# Altium project IDC_SMA_Adapter.PrjPCB
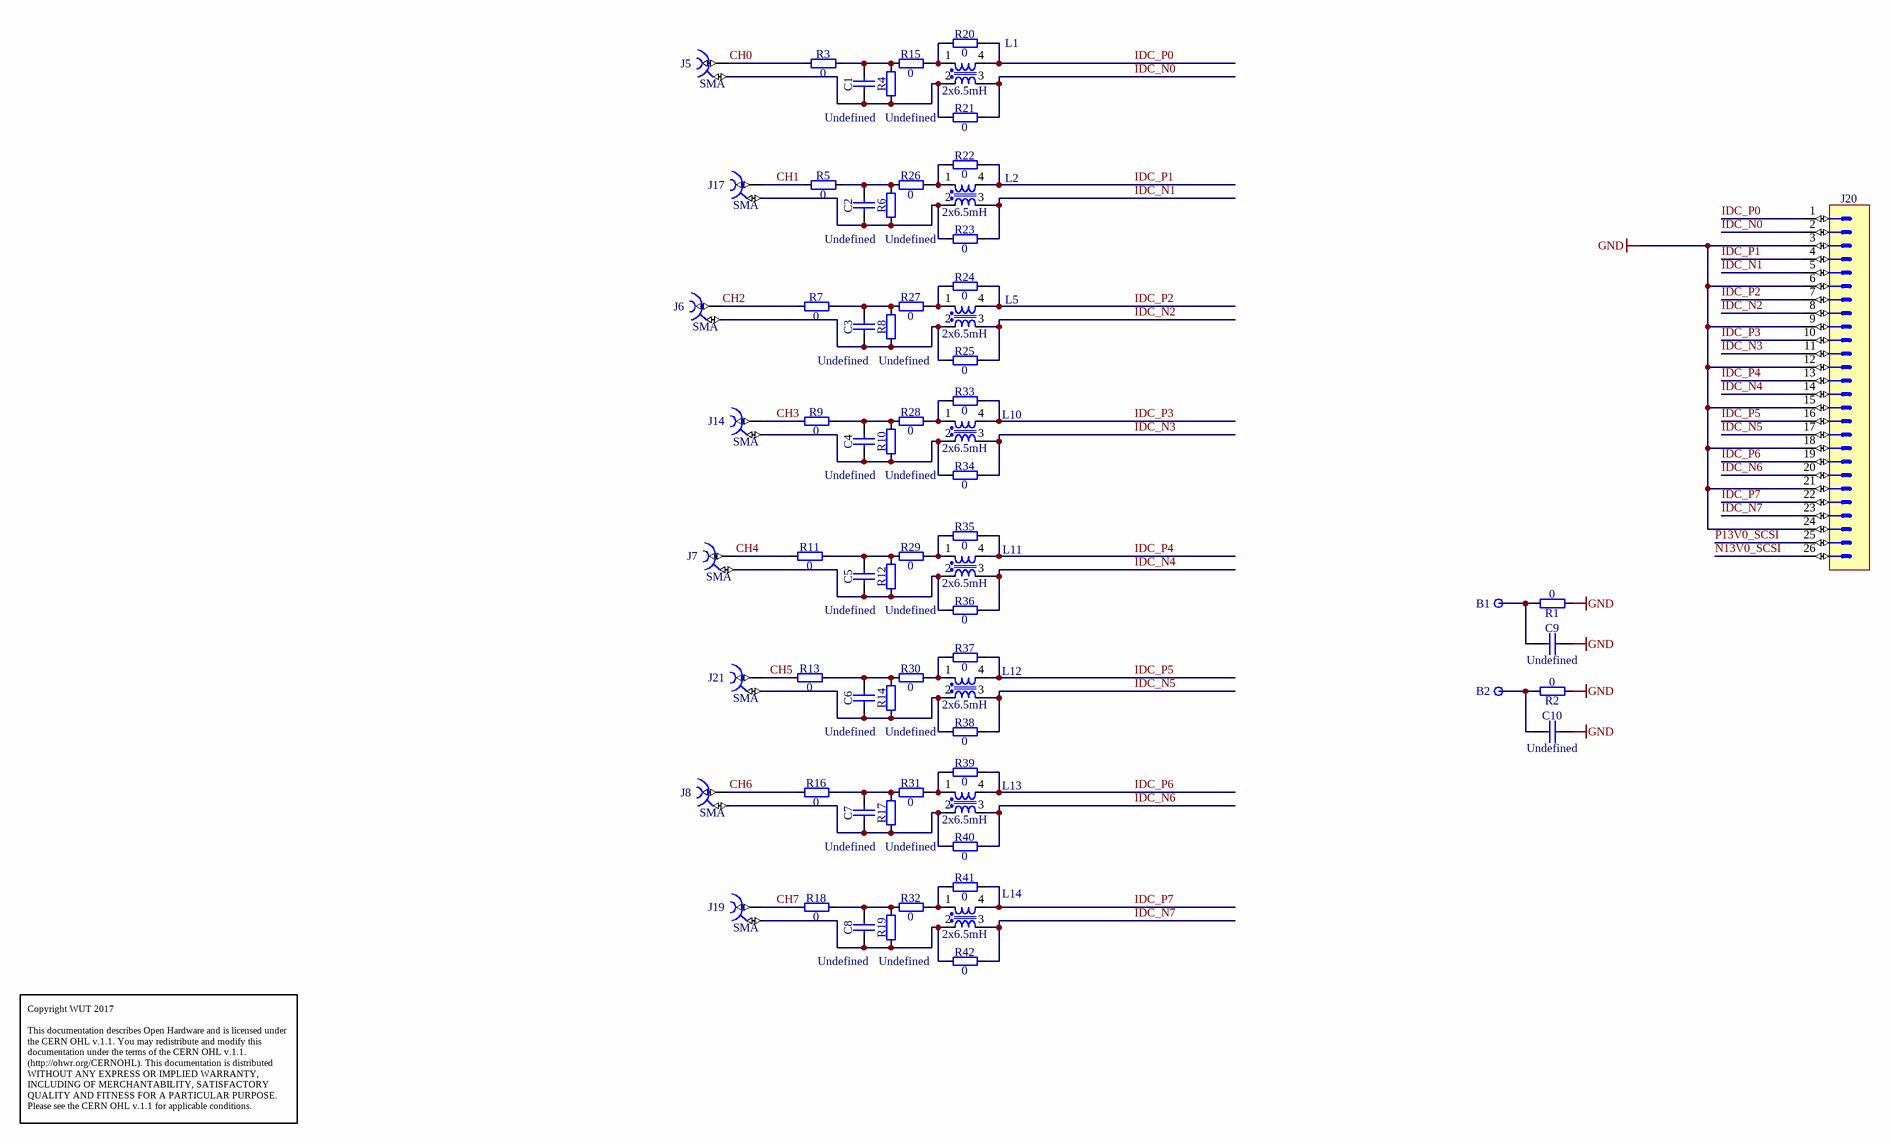
[diagram p0: IDC_SMA_Adapter.SchDoc]
1 sheet, 71 parts. Net scope: global (net labels, ports and power ports of the same name join across sheets).
Board files: IDC_SMA_Adapter.PCBDOC, Panel_IDC_SMA_Adapter.PcbDoc

## Sheet IDC_SMA_Adapter.SchDoc: IDC to SMA
size 420 x 297 mm; Author: G.K.; CompanyName: WUT; DrawnBy: G.K.; Organization: WUT ISE; Address1: Warsaw Univeristy of Technology; Address2: Nowowiejska 15/19; DocumentNumber: 3; Revision: -; SheetNumber: 3; SheetTotal: 7; EDA_Number: ARTIQ; Projet: ARTIQ/SINARA; ModifiedBy: -; CreateDate: XX/XX/XXXX; CheckedDate: -; Title2: adapter v1.0; DivGrp: ISE; Designer: G.K.; ModifiedDate: -; ProjectName: 32 CHANNEL 16bit DAC

### Parts
B1  Plated Hole  [MTG270_500]  (value not drawn)
B2  Plated Hole  [MTG270_500]  (value not drawn)
C1  Undefined  [CAPC2012X135N]
C2  Undefined  [CAPC2012X135N]
C3  Undefined  [CAPC2012X135N]
C4  Undefined  [CAPC2012X135N]
C5  Undefined  [CAPC2012X135N]
C6  Undefined  [CAPC2012X135N]
C7  Undefined  [CAPC2012X135N]
C8  Undefined  [CAPC2012X135N]
C9  Undefined  [CAPC2012X135N]
C10  Undefined  [CAPC2012X135N]
J5  SMA  [DELOCK_65848]
J6  SMA  [DELOCK_65848]
J7  SMA  [DELOCK_65848]
J8  SMA  [DELOCK_65848]
J14  SMA  [MOLEX_73251-2120]
J17  SMA  [MOLEX_73251-2120]
J19  SMA  [MOLEX_73251-2120]
J20  Header 26  [3M_N2526-6003RB]  (value not drawn)
J21  SMA  [MOLEX_73251-2120]
L1  2x6.5mH  [IND_WURTH_WE-SL2]
L2  2x6.5mH  [IND_WURTH_WE-SL2]
L5  2x6.5mH  [IND_WURTH_WE-SL2]
L10  2x6.5mH  [IND_WURTH_WE-SL2]
L11  2x6.5mH  [IND_WURTH_WE-SL2]
L12  2x6.5mH  [IND_WURTH_WE-SL2]
L13  2x6.5mH  [IND_WURTH_WE-SL2]
L14  2x6.5mH  [IND_WURTH_WE-SL2]
R1  0  [RESC1608X55N]
R2  0  [RESC1608X55N]
R3  0  [RESC1608X55N]
R4  Undefined  [RESC1608X55N]
R5  0  [RESC1608X55N]
R6  Undefined  [RESC1608X55N]
R7  0  [RESC1608X55N]
R8  Undefined  [RESC1608X55N]
R9  0  [RESC1608X55N]
R10  Undefined  [RESC1608X55N]
R11  0  [RESC1608X55N]
R12  Undefined  [RESC1608X55N]
R13  0  [RESC1608X55N]
R14  Undefined  [RESC1608X55N]
R15  0  [RESC1608X55N]
R16  0  [RESC1608X55N]
R17  Undefined  [RESC1608X55N]
R18  0  [RESC1608X55N]
R19  Undefined  [RESC1608X55N]
R20  0  [RESC1608X55N]
R21  0  [RESC1608X55N]
R22  0  [RESC1608X55N]
R23  0  [RESC1608X55N]
R24  0  [RESC1608X55N]
R25  0  [RESC1608X55N]
R26  0  [RESC1608X55N]
R27  0  [RESC1608X55N]
R28  0  [RESC1608X55N]
R29  0  [RESC1608X55N]
R30  0  [RESC1608X55N]
R31  0  [RESC1608X55N]
R32  0  [RESC1608X55N]
R33  0  [RESC1608X55N]
R34  0  [RESC1608X55N]
R35  0  [RESC1608X55N]
R36  0  [RESC1608X55N]
R37  0  [RESC1608X55N]
R38  0  [RESC1608X55N]
R39  0  [RESC1608X55N]
R40  0  [RESC1608X55N]
R41  0  [RESC1608X55N]
R42  0  [RESC1608X55N]

### Nets
GND: C9.2 C10.2 J20.3 J20.6 J20.9 J20.12 J20.15 J20.18 J20.21 J20.24 R1.1 R2.1
CH0: J5.1 R3.1
CH1: J17.1 R5.1
CH2: J6.1 R7.1
CH3: J14.1 R9.1
CH4: J7.1 R11.1
CH5: J21.1 R13.1
CH6: J8.1 R16.1
CH7: J19.1 R18.1
IDC_N0: J20.2 L1.3 R21.2
IDC_N1: J20.5 L2.3 R23.2
IDC_N2: J20.8 L5.3 R25.2
IDC_N3: J20.11 L10.3 R34.2
IDC_N4: J20.14 L11.3 R36.2
IDC_N5: J20.17 L12.3 R38.2
IDC_N6: J20.20 L13.3 R40.2
IDC_N7: J20.23 L14.3 R42.2
IDC_P0: J20.1 L1.4 R20.2
IDC_P1: J20.4 L2.4 R22.2
IDC_P2: J20.7 L5.4 R24.2
IDC_P3: J20.10 L10.4 R33.2
IDC_P4: J20.13 L11.4 R35.2
IDC_P5: J20.16 L12.4 R37.2
IDC_P6: J20.19 L13.4 R39.2
IDC_P7: J20.22 L14.4 R41.2
N13V0_SCSI: J20.26
P13V0_SCSI: J20.25
NetB1_1: B1.1 C9.1 R1.2
NetB2_1: B2.1 C10.1 R2.2
NetC1_1: C1.1 J5.2 L1.2 R4.1 R21.1
NetC1_2: C1.2 R3.2 R4.2 R15.1
NetC2_1: C2.1 J17.2 L2.2 R6.1 R23.1
NetC2_2: C2.2 R5.2 R6.2 R26.1
NetC3_1: C3.1 J6.2 L5.2 R8.1 R25.1
NetC3_2: C3.2 R7.2 R8.2 R27.1
NetC4_1: C4.1 J14.2 L10.2 R10.1 R34.1
NetC4_2: C4.2 R9.2 R10.2 R28.1
NetC5_1: C5.1 J7.2 L11.2 R12.1 R36.1
NetC5_2: C5.2 R11.2 R12.2 R29.1
NetC6_1: C6.1 J21.2 L12.2 R14.1 R38.1
NetC6_2: C6.2 R13.2 R14.2 R30.1
NetC7_1: C7.1 J8.2 L13.2 R17.1 R40.1
NetC7_2: C7.2 R16.2 R17.2 R31.1
NetC8_1: C8.1 J19.2 L14.2 R19.1 R42.1
NetC8_2: C8.2 R18.2 R19.2 R32.1
NetL1_1: L1.1 R15.2 R20.1
NetL2_1: L2.1 R22.1 R26.2
NetL5_1: L5.1 R24.1 R27.2
NetL10_1: L10.1 R28.2 R33.1
NetL11_1: L11.1 R29.2 R35.1
NetL12_1: L12.1 R30.2 R37.1
NetL13_1: L13.1 R31.2 R39.1
NetL14_1: L14.1 R32.2 R41.1

### Notes on the sheet
- Copyright WUT 2017
  This documentation describes Open Hardware and is licensed under the CERN OHL v.1.1. You may redistribute and modify this documentation under the terms of the CERN OHL v.1.1. (http://ohwr.org/CERNOHL). This documentation is distributed WITHOUT ANY EXPRESS OR IMPLIED WARRANTY, INCLUDING OF MERCHANTABILITY, SATISFACTORY QUALITY AND FITNESS FOR A PARTICULAR PURPOSE. Please see the CERN OHL v.1.1 for applicable conditions.
- Project/Equipment
- Document
- Designer
- Drawn by
- Check.by
- Copyright WUT ISE 2018.
  This documentation describes Open Hardware and is licensed under the CERN OHL v.1.1. You may redistribute and modify this documentation under the terms of the CERN OHL v.1.1. (http://ohwr.org/CERNOHL). This documentation is distributed WITHOUT ANY EXPRESS OR IMPLIED WARRANTY, INCLUDING OF MERCHANTABILITY, SATISFACTORY QUALITY AND FITNESS FOR A PARTICULAR PURPOSE. Please see the CERN OHL v.1.1 for applicable conditions.
- Contact
- File
- Last Mod.
- Print Date
- Sheet
- Size
- A3
- of
- Rev

### Library data of the parts
B1 B2 = PLATED_HOLE2.7_PAD5.0: Single Terminal Socket; Part Description: Plated Through Hole: Hole Dia.=2.7mm Pad Dia.=5.0mm; Mounted: No; Part Number: PLATED_HOLE2.7_PAD5.0; Component Kind: Standard (No BOM); Component Type: Standard (No BOM); Pin Count: 1; Family: Plated Hole; Socket: No; SMD: No; Sense: No; Status: None; ComponentHeight: 0mm; HelpURL: Undefined; Author: CERN DEM JMW; CreateDate: 27.09.2011; LatestRevisionDate: 27.09.2011; PackageDescription: Plated Through Hole: Hole Dia.=2.7mm Pad Dia.=5.0mm
C1-C10 = CC0805_NO-VALUE: Non-polarised capacitor; Part Description: Reserved Footprint For 0805(2012) Chip Ceramic Capacitor; Mounted: No; Part Number: CC0805_NO-VALUE; Component Kind: Standard; Component Type: Standard; Pin Count: 2; Value: Undefined; Status: None; Manufacturer: Undefined; Manufacturer Part Number: CC0805_NO-VALUE; Case: 0805; Socket: No; SMD: Yes; Sense: No; Manufacturer1 ComponentHeight: 1.35mm; HelpURL: Undefined; Author: CERN DEM JLC; CreateDate: 10.12.2008; LatestRevisionDate: 11.09.2013
J5-J8 = CON_SMA_DELOCK_65848: 50 Ohm Through Hole SMA Right Angle PCB Jack; Manufacturer: DELOCK; Manufacturer Part Number: 5848 (4043619658480); PressFit: No; Part Number: DELOCK_65848; Component Kind: Standard; Component Type: Standard; Pin Count: 5; Family: SMA; Mounted: Yes; Socket: No; SMD: No; Sense: No; Status: None; Part Description: 50 Ohm Through Hole SMA Right Angle PCB Jack; ComponentHeight: 12.5; HelpURL: \\cern.ch\dfs\Applications\Altium\Datasheets\AMPHENOL_132203-16.pdf; Author: GK; CreateDate: 13.05.2019; LatestRevisionDate: 13.05.2019
J14 J17 J19 J21 = CON_SMA_RA_SMD_73251-2120: 50 Ohm, SMA Edge Mount PCB, With Jam Nut And Lock Washer; Manufacturer: MOLEX; PressFit: No; Part Number: MOLEX_73251-2120; Component Kind: Standard; Component Type: Standard; Pin Count: 5; Family: SMA; Mounted: Yes; Socket: No; SMD: Yes; Sense: No; Status: None; Part Description: 50 Ohm, SMA Edge Mount PCB, With Jam Nut And Lock Washer; Manufacturer Part Number: 73251-2120; ComponentHeight: 5.75mm; HelpURL: \\cern.ch\dfs\Applications\Altium\Datasheets\MOLEX_73251-2121.pdf; Author: CERN DEM JLC; CreateDate: 26.10.2016; LatestRevisionDate: 26.10.2016
J20 = 3M_N2526-6003RB: Connector 26 Male; Part Description: 26 Contacts - Straight .100'' x .100'' Low Profile Four-Wall Header, 2500 Series; Manufacturer: 3M; PressFit: No; Part Number: 3M_N2526-6003RB; Component Kind: Standard; Component Type: Standard; Pin Count: 26; Family: Header 26; Mounted: Yes; Socket: No; SMD: No; Sense: No; Status: None; Manufacturer Part Number: N2526-6003RB; ComponentHeight: 9.91mm; HelpURL: \\cern.ch\dfs\Applications\Altium\Datasheets\3M_N2526-6003RB.pdf; Author: CERN DEM JLC; CreateDate: 22.01.2014; LatestRevisionDate: 22.01.2014
L1 L2 L5 L10-L14 = IND_6.5MH_50%_WURTH_WE-SL2-744229: Inductor Common Mode; Part Description: Common Mode SMD Line Filter (WE-SL2 Serie); Manufacturer: WURTH ELEKTRONIK; Manufacturer Part Number: 744229; Power: 400mA; Resistance: 0.95R; Tolerance: ±50%; Part Number: IND_6.5MH_50%_WURTH_WE-SL2-744229; Component Kind: Standard; Component Type: Standard; Pin Count: 4; Value: 2x6.5mH; Status: None; Mounted: Yes; Socket: No; SMD: Yes; Sense: No; ComponentHeight: 5.3mm; HelpURL: \\cern.ch\dfs\Applications\Altium\Datasheets\IND_WURTH_WE-SL2_744229.pdf; Author: CERN DEM JLC; CreateDate: 01.10.2012; LatestRevisionDate: 15.10.2012
R1 R2 = R0603_0R_JUMPER: Resistor; Part Description: 1A (0.05R Max DC Resistance) Zero Ohm Jumper; Manufacturer: GENERIC; Manufacturer1 Part Number: NRC06Z0; PressFit: No; Part Number: R0603_0R_JUMPER; Component Kind: Standard; Component Type: Standard; Pin Count: 2; Value: 0; Status: Preferred; Manufacturer Part Number: R0603_0R_JUMPER; Case: 0603; Mounted: Yes; Sense: No; Socket: No; SMD: Yes; Manufacturer1 Example: NIC COMPONENT; Manufacturer1 ComponentHeight: 0.55mm; HelpURL: \\cern.ch\dfs\Applications\Altium\Datasheets\R0603_NIC_NRC.pdf; Author: CERN DEM JLC; CreateDate: 03.12.2007; LatestRevisionDate: 13.03.2008
R3 R5 R7 R9 R11 R13 R15 R16 R18 R20-R42 = R0603_0R_JUMPER: Resistor; Part Description: 1A (0.05R Max DC Resistance) Zero Ohm Jumper; Manufacturer: GENERIC; Manufacturer1 Part Number: NRC06Z0; Part Number: R0603_0R_JUMPER; Component Kind: Standard; Component Type: Standard; Pin Count: 2; Value: 0; Status: Preferred; Manufacturer Part Number: R0603_0R_JUMPER; Case: 0603; Mounted: Yes; Sense: No; Socket: No; SMD: Yes; Manufacturer1 Example: NIC COMPONENT; Manufacturer1 ComponentHeight: 0.55mm; HelpURL: \\cern.ch\dfs\Applications\Altium\Datasheets\R0603_NIC_NRC.pdf; Author: CERN DEM JLC; CreateDate: 03.12.2007; LatestRevisionDate: 13.03.2008
R4 R6 R8 R10 R12 R14 R17 R19 = R0603_NO-VALUE: Resistor; Part Description: Reserved Footprint For a 0603 (1608) Chip Resistor; PressFit: No; Mounted: No; Part Number: R0603_NO-VALUE; Component Kind: Standard; Component Type: Standard; Pin Count: 2; Value: Undefined; Status: None; Manufacturer: Undefined; Manufacturer Part Number: R0603_NO-VALUE; Case: 0603; Sense: No; Socket: No; SMD: Yes; Manufacturer1 Example: Undefined; Manufacturer1 Part Number: Undefined; Manufacturer1 ComponentHeight: Undefined; HelpURL: Undefined; Author: CERN DEM JLC; CreateDate: 03.12.2007; LatestRevisionDate: 13.03.2008

## Assembly variants
default: not fitted C1 C2 C3 C4 C5 C6 C7 C8 R4 R6 R8 R10 R12 R14 R17 R19 R20 R21 R22 R23 R24 R25 R33 R34 R35 R36 R37 R38 R39 R40 R41 R42